# EAGLE design robot001 (EAGLE 9.5.1)

## Sheet 1 of 3
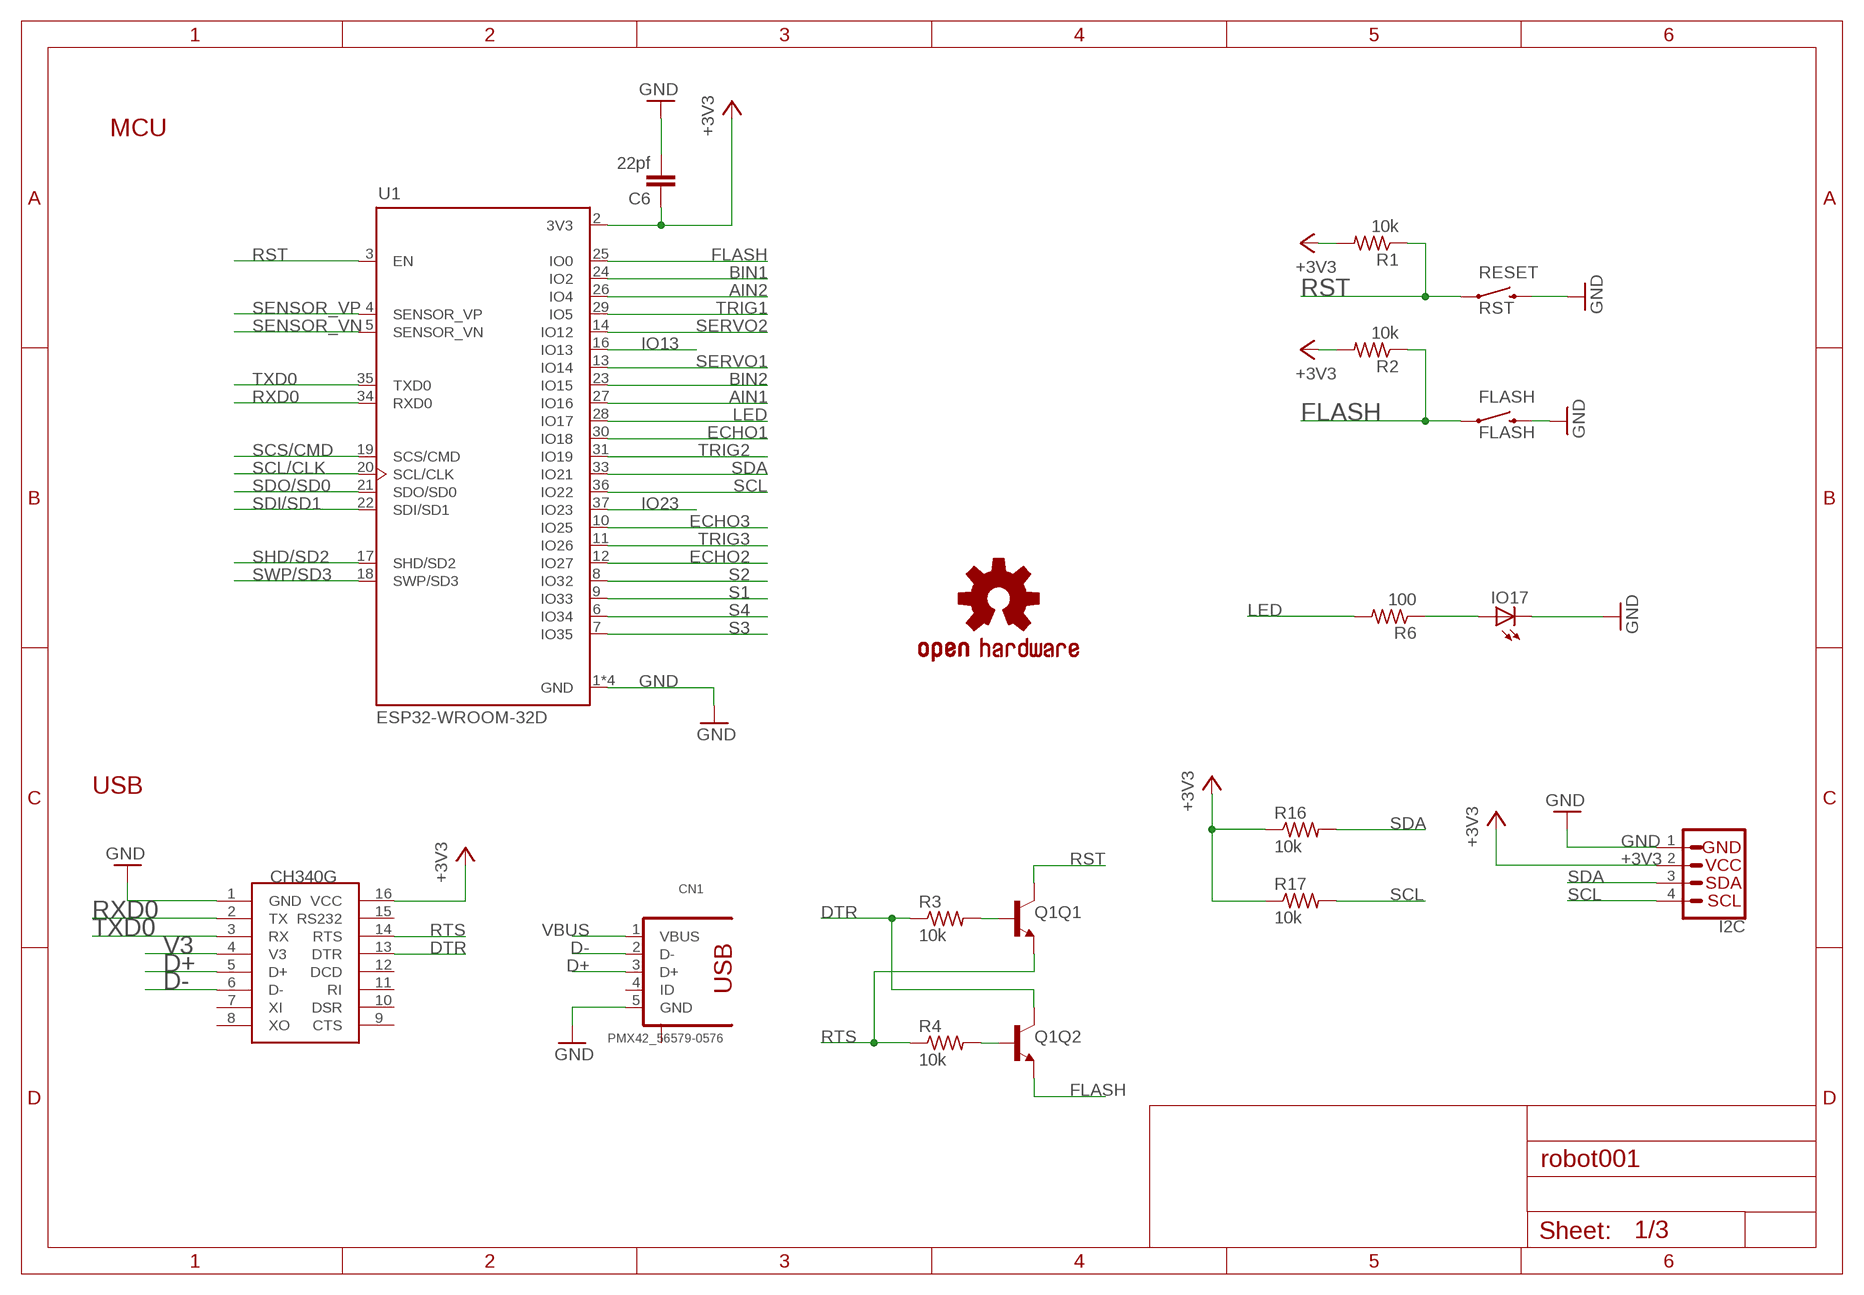
[diagram p0: schematic, sheet 1]

### Parts
C6  22pf  C-EUC0402  [C0402]
CN1  PMX42_56579-0576  [PMX42_56579-0576]
FLASH  FLASH  RS032G05A3SM-SPST-MOMENTARY-SWSMD-1101NE  [TACTILE-SWITCH-1101NE]
I2C  I2C_STANDARD  [1X04]
IO17  LEDCHIPLED_1206  [CHIPLED_1206]
LOGO1  OSHW-LOGOS  [OSHW-LOGO-S]
Q1  TRANS_NPN_DUAL-MBT3904DW1T1  [SC70-6]
R1  10k  R-US_R0402  [R0402]
R2  10k  R-US_R0402  [R0402]
R3  10k  R-US_R0402  [R0402]
R4  10k  R-US_R0402  [R0402]
R6  100  R-US_R0402  [R0402]
R16  10k  R-US_R0402  [R0402]
R17  10k  R-US_R0402  [R0402]
RESET  RST  RS032G05A3SM-SPST-MOMENTARY-SWSMD-1101NE  [TACTILE-SWITCH-1101NE]
U1  ESP32-WROOM-32D  [MODULE_ESP32-WROOM-32D]
U$1  CH340G  [SOIC16]

### Nets
+3V3: C6.1 I2C.2 R1.2 R2.2 R16.1 R17.1 U1.2(3V3) U$1.16(VCC) ; also sheet 2,3
AIN1: U1.27(IO16) ; also sheet 2
AIN2: U1.26(IO4) ; also sheet 2
BIN1: U1.24(IO2) ; also sheet 2
BIN2: U1.23(IO15) ; also sheet 2
D+: CN1.3(D+) U$1.5(D+)
D-: CN1.2(D-) U$1.6(D-)
DTR: Q1.6(Q2:C) R3.1 U$1.13(DTR)
ECHO1: U1.30(IO18) ; also sheet 2
ECHO2: U1.12(IO27) ; also sheet 2
ECHO3: U1.10(IO25) ; also sheet 2
FLASH: FLASH.1 Q1.1(Q2:E) R2.1 U1.25(IO0)
GND: C6.2 CN1.5(GND) FLASH.2 I2C.1 IO17.C RESET.2 U1.1(GND) U1.15(GND) U1.38(GND) U1.39(GND) U$1.1(GND) ; also sheet 2,3
IO13: U1.16(IO13)
IO23: U1.37(IO23)
LED: R6.2 U1.28(IO17)
N$1: Q1.5(Q1:B) R3.2
N$2: Q1.2(Q2:B) R4.2
N$4: IO17.A R6.1
RST: Q1.3(Q1:C) R1.1 RESET.1 U1.3(EN)
RTS: Q1.4(Q1:E) R4.1 U$1.14(RTS)
RXD0: U1.34(RXD0) U$1.2(TX)
S1: U1.9(IO33) ; also sheet 2
S2: U1.8(IO32) ; also sheet 2
S3: U1.7(IO35) ; also sheet 2
S4: U1.6(IO34) ; also sheet 2
SCL: I2C.4 R17.2 U1.36(IO22)
SCL/CLK: U1.20(SCL/CLK)
SCS/CMD: U1.19(SCS/CMD)
SDA: I2C.3 R16.2 U1.33(IO21)
SDI/SD1: U1.22(SDI/SD1)
SDO/SD0: U1.21(SDO/SD0)
SENSOR_VN: U1.5(SENSOR_VN)
SENSOR_VP: U1.4(SENSOR_VP)
SERVO1: U1.13(IO14) ; also sheet 2
SERVO2: U1.14(IO12) ; also sheet 2
SHD/SD2: U1.17(SHD/SD2)
SWP/SD3: U1.18(SWP/SD3)
TRIG1: U1.29(IO5) ; also sheet 2
TRIG2: U1.31(IO19) ; also sheet 2
TRIG3: U1.11(IO26) ; also sheet 2
TXD0: U1.35(TXD0) U$1.3(RX)
V3: U$1.4(V3)
VBUS: CN1.1(VBUS) ; also sheet 2
Unconnected: CN1.4(ID) CN1.S1(S) CN1.S2(S) CN1.S3(S) CN1.S4(S) U$1.7(XI) U$1.8(XO) U$1.9(CTS) U$1.10(DSR) U$1.11(RI) U$1.12(DCD) U$1.15(RS232)

### Notes on the sheet
- MCU
- USB

## Sheet 2 of 3
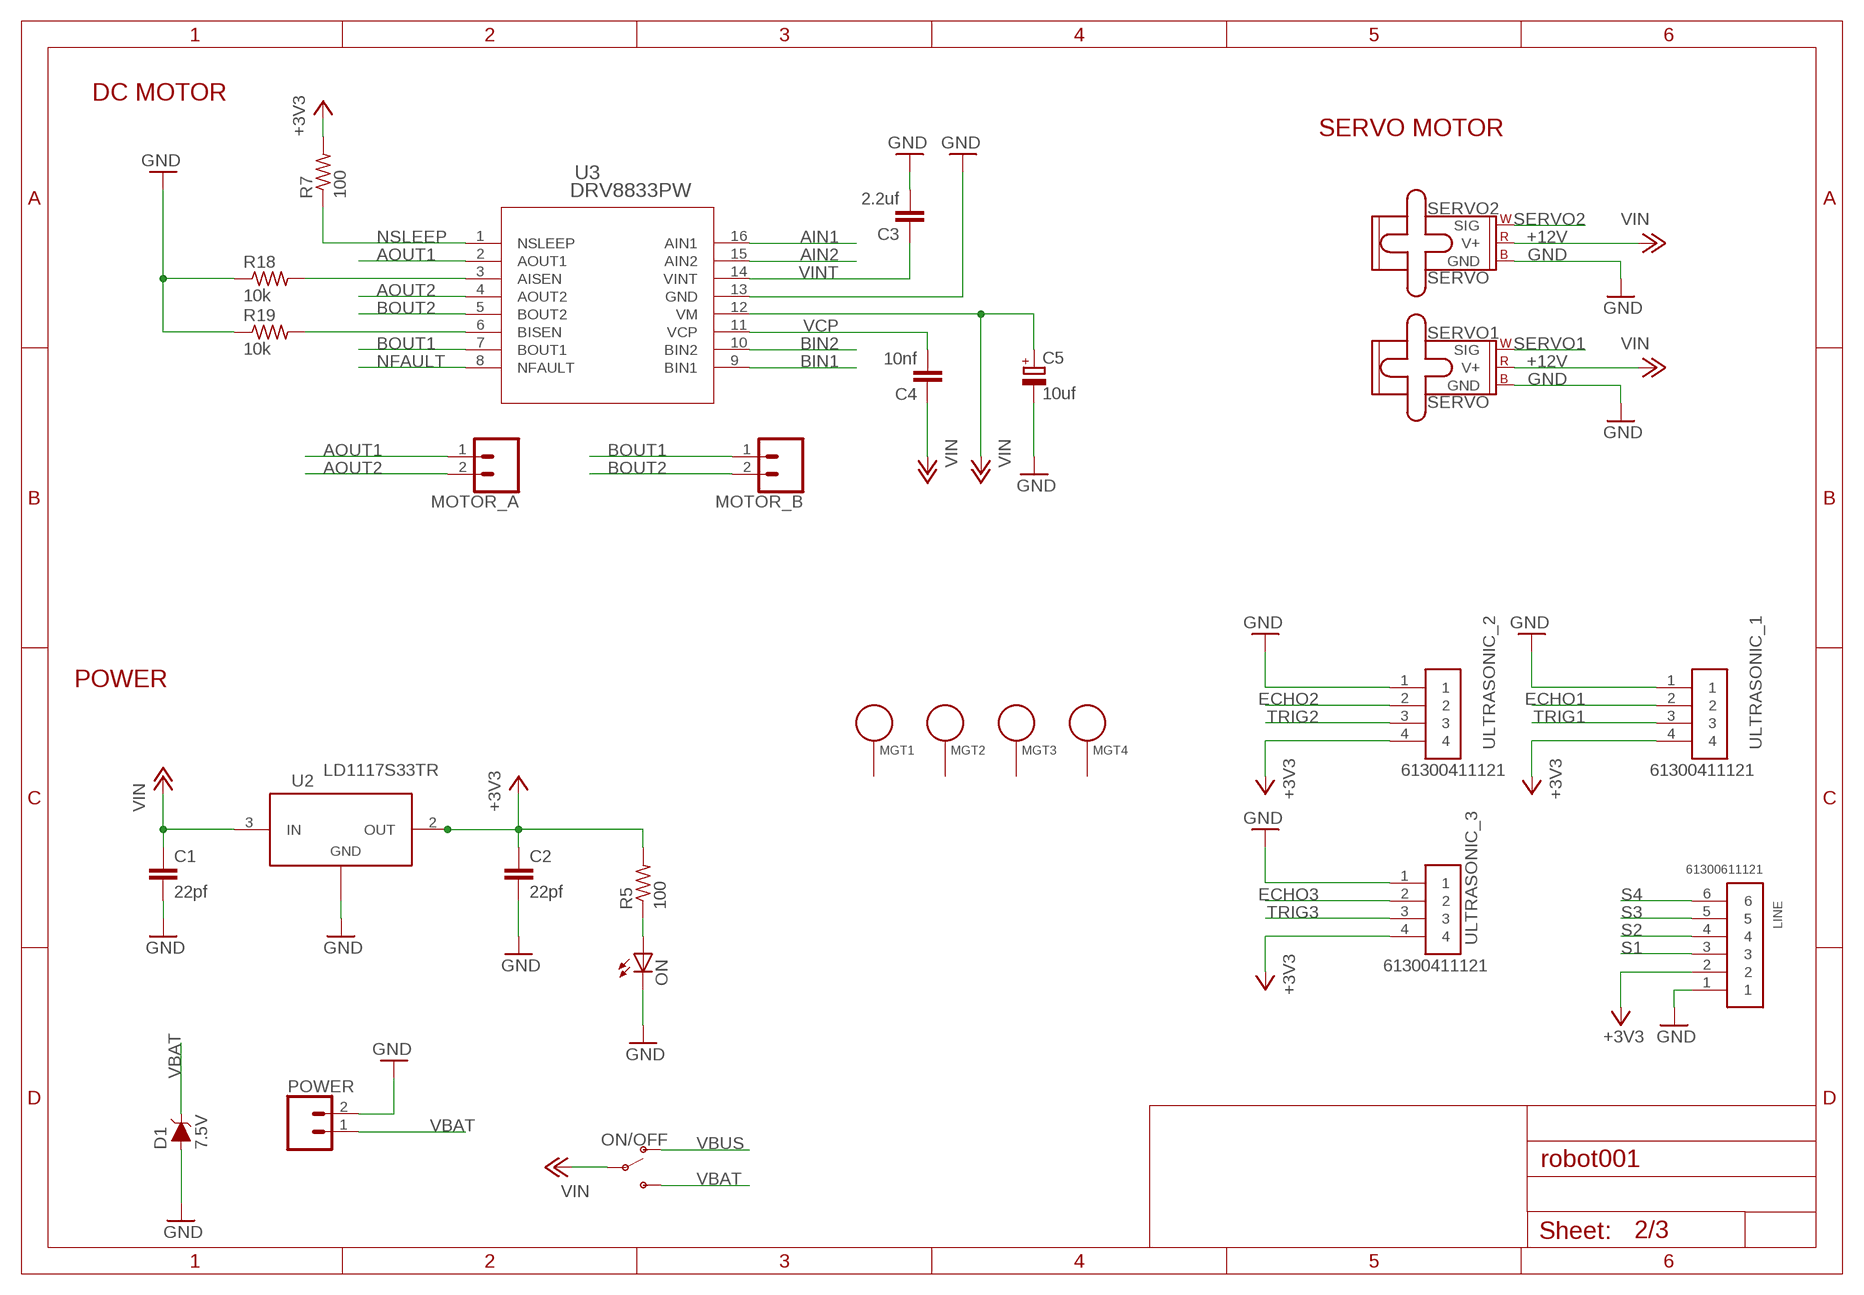
[diagram p1: schematic, sheet 2]

### Parts
C1  22pf  C-EUC0402  [C0402]
C2  22pf  C-EUC0402  [C0402]
C3  2.2uf  C-EUC0402  [C0402]
C4  10nf  C-EUC0402  [C0402]
C5  10uf  CPOL-EUB  [PANASONIC_B]
D1  7.5V  DIODE-ZENER-BZT52C3V6S  [SOD-323]
LINE  61300611121  [61300611121]
MGT1  BEAGLEBONEBLACK_MOUNTING_HOLE  [BEAGLEBONEBLACK_MOUNTING_HOLE]
MGT2  BEAGLEBONEBLACK_MOUNTING_HOLE  [BEAGLEBONEBLACK_MOUNTING_HOLE]
MGT3  BEAGLEBONEBLACK_MOUNTING_HOLE  [BEAGLEBONEBLACK_MOUNTING_HOLE]
MGT4  BEAGLEBONEBLACK_MOUNTING_HOLE  [BEAGLEBONEBLACK_MOUNTING_HOLE]
MOTOR_A  CONN_02  [1X02]
MOTOR_B  CONN_02  [1X02]
ON  LEDCHIPLED_1206  [CHIPLED_1206]
ON/OFF  SWITCH-SPDT-SMD-AYZ0202  [SWITCH_DPDT_SMD_AYZ0202]
POWER  CONN_02  [1X02]
R5  100  R-US_R0402  [R0402]
R7  100  R-US_R0402  [R0402]
R18  10k  R-US_R0402  [R0402]
R19  10k  R-US_R0402  [R0402]
SERVO1  SERVO  [1X03]
SERVO2  SERVO  [1X03]
U2  LD1117S33TR  [SOT-223]
U3  DRV8833PW  [PW16]
ULTRASONIC_1  61300411121  [61300411121]
ULTRASONIC_2  61300411121  [61300411121]
ULTRASONIC_3  61300411121  [61300411121]

### Nets
+3V3: C2.1 LINE.2 R5.2 R7.2 U2.2(OUT) U2.4 ULTRASONIC_1.4 ULTRASONIC_2.4 ULTRASONIC_3.4 ; also sheet 1,3
+12V: C1.1 C4.1 C5.+ ON/OFF.2(P) SERVO1.2(V+) SERVO2.2(V+) U2.3(IN) U3.12(VM) ; supply symbol labelled VIN
AIN1: U3.16(AIN1) ; also sheet 1
AIN2: U3.15(AIN2) ; also sheet 1
AOUT1: MOTOR_A.1 U3.2(AOUT1)
AOUT2: MOTOR_A.2 U3.4(AOUT2)
BIN1: U3.9(BIN1) ; also sheet 1
BIN2: U3.10(BIN2) ; also sheet 1
BOUT1: MOTOR_B.1 U3.7(BOUT1)
BOUT2: MOTOR_B.2 U3.5(BOUT2)
ECHO1: ULTRASONIC_1.2 ; also sheet 1
ECHO2: ULTRASONIC_2.2 ; also sheet 1
ECHO3: ULTRASONIC_3.2 ; also sheet 1
GND: C1.2 C2.2 C3.2 C5.- D1.A LINE.1 ON.C POWER.2 R18.1 R19.1 SERVO1.3(GND) SERVO2.3(GND) U2.1(ADJ/GND) U3.13(GND) ULTRASONIC_1.1 ULTRASONIC_2.1 ULTRASONIC_3.1 ; also sheet 1,3
N$3: ON.A R5.1
N$9: R18.2 U3.3(AISEN)
N$10: R19.2 U3.6(BISEN)
NFAULT: U3.8(NFAULT)
NSLEEP: R7.1 U3.1(NSLEEP)
S1: LINE.3 ; also sheet 1
S2: LINE.4 ; also sheet 1
S3: LINE.5 ; also sheet 1
S4: LINE.6 ; also sheet 1
SERVO1: SERVO1.1(SIG) ; also sheet 1
SERVO2: SERVO2.1(SIG) ; also sheet 1
TRIG1: ULTRASONIC_1.3 ; also sheet 1
TRIG2: ULTRASONIC_2.3 ; also sheet 1
TRIG3: ULTRASONIC_3.3 ; also sheet 1
VBAT: D1.C ON/OFF.3(S) POWER.1
VBUS: ON/OFF.1(O) ; also sheet 1
VCP: C4.2 U3.11(VCP)
VINT: C3.1 U3.14(VINT)
Unconnected: MGT1.P$1 MGT2.P$1 MGT3.P$1 MGT4.P$1

### Notes on the sheet
- DC MOTOR
- SERVO MOTOR
- POWER

## Sheet 3 of 3
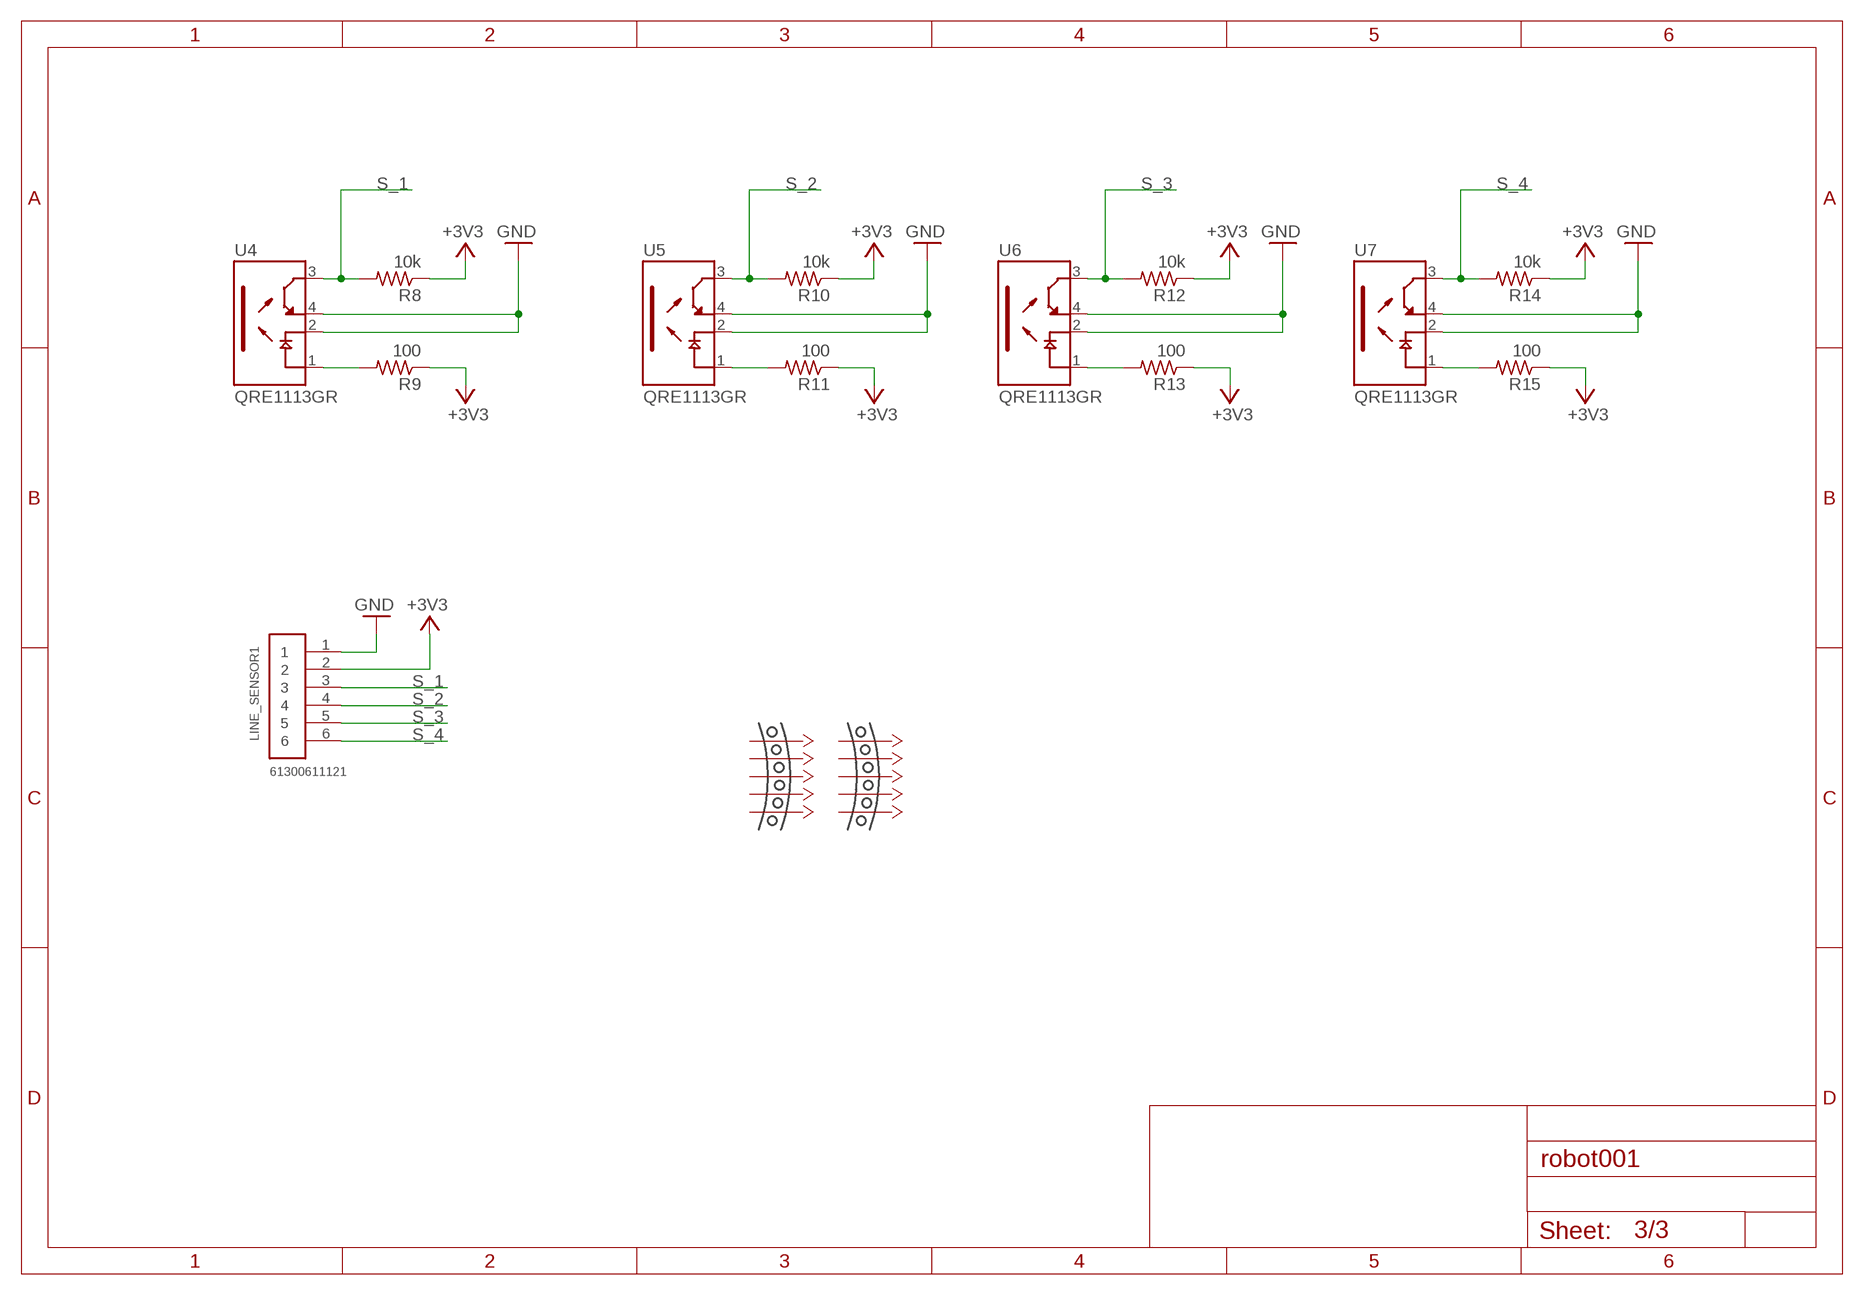
[diagram p2: schematic, sheet 3]

### Parts
LINE_SENSOR1  61300611121  [61300611121]
R8  10k  R-US_R0402  [R0402]
R9  100  R-US_R0402  [R0402]
R10  10k  R-US_R0402  [R0402]
R11  100  R-US_R0402  [R0402]
R12  10k  R-US_R0402  [R0402]
R13  100  R-US_R0402  [R0402]
R14  10k  R-US_R0402  [R0402]
R15  100  R-US_R0402  [R0402]
U4  QRE1113GR  [SOIC180P460X187-4N]
U5  QRE1113GR  [SOIC180P460X187-4N]
U6  QRE1113GR  [SOIC180P460X187-4N]
U7  QRE1113GR  [SOIC180P460X187-4N]
U$2  MOUSE-BITES-5  [MOUSE-BITES-5]
U$3  MOUSE-BITES-5  [MOUSE-BITES-5]

### Nets
+3V3: LINE_SENSOR1.2 R8.1 R9.1 R10.1 R11.1 R12.1 R13.1 R14.1 R15.1 ; also sheet 1,2
GND: LINE_SENSOR1.1 U4.2(C) U4.4(ET) U5.2(C) U5.4(ET) U6.2(C) U6.4(ET) U7.2(C) U7.4(ET) ; also sheet 1,2
N$5: R11.2 U5.1(A)
N$6: R9.2 U4.1(A)
N$7: R13.2 U6.1(A)
N$8: R15.2 U7.1(A)
S_1: LINE_SENSOR1.3 R8.2 U4.3(CT)
S_2: LINE_SENSOR1.4 R10.2 U5.3(CT)
S_3: LINE_SENSOR1.5 R12.2 U6.3(CT)
S_4: LINE_SENSOR1.6 R14.2 U7.3(CT)
Unconnected: U$2.1 U$2.2 U$2.3 U$2.4 U$2.5 U$3.1 U$3.2 U$3.3 U$3.4 U$3.5

## Library data of the parts
C1-C4 C6 = resistor:C-EU: CAPACITOR, European symbol
C5 = resistor:CPOL-EU: POLARIZED CAPACITOR, European symbol
CN1 = 52101-101-REV-A:PMX42_56579-0576: USB - OTG, miniUSB Type AB, Molex
D1 = SparkFun-DiscreteSemi:DIODE-ZENER: Zener Diode A Zener diode allows current to flow from its anode to its cathode like a normal semiconductor diode, but it also permits current to flow in the reverse direction when its "Zener voltage" is reached. - WIkipedia; PROD_ID: DIO-08199; VALUE: 3.6V
FLASH RESET = BeagleBone_Blue_R3:RS032G05A3SM-SPST-MOMENTARY-SW: 6x3.5mm 2-pin Momentary Switch (Push-button) Digikey Link <https://www.digikey.com/products/en?keywords=CKN10388TR-ND> Datasheet <https://media.digikey.com/pdf/Data%20Sheets/C&K/RS-032G05_-SM_RT.pdf>; PROD_ID: SWCH-00815
I2C = SparkFun-Connectors:I2C_STANDARD: SparkFun I2C Standard Pinout Header SparkFun has standardized on a pinout for all I2C based sensor breakouts. This pinout allows I2C boards to be plugged directly into the headers on Arduino Uno compatible boards, and to be daisy chained easily. Example SparkFun Products: SparkFun Atmospheric Sensor Breakout - BME280 <https://www.sparkfun.com/products/13676> SparkFun Altitude/Pressure Sensor Breakout - MPL3115A2 <https://www.sparkfun.com/products/11084> SparkFun TOF Range Finder Sensor - VL6180 <https://www.sparkfun.com/products/12785>
IO17 ON = adafruit:LED: LED OSRAM: - CHIPLED LG R971, LG N971, LY N971, LG Q971, LY Q971, LO R971, LY R971 LH N974, LH R974 LS Q976, LO Q976, LY Q976 LO Q996 - Hyper CHIPLED LW Q18S LB Q993, LB Q99A, LB R99A - SideLED LS A670, LO A670, LY A670, LG A670, LP A670 LB A673, LV A673, LT A673, LW A673 LH A674 LY A675 LS A676, LA A676, LO A676, LY A676, LW A676 LS A679, LY A679, LG A679 - Hyper Micro SIDELED® LS Y876, LA Y876, LO Y876, LY Y876 LT Y87S - SmartLED LW L88C, LW L88S LB L89C, LB L89S, LG L890 LS L89K, LO L89K, LY L89K LS L896, LA L896, LO L896, LY L896 - TOPLED LS T670, LO T670, LY T670, LG T670, LP T670 LSG T670, LSP T670, LSY T670, LOP T670, LYG T670 LG T671, LOG T671, LSG T671 LB T673, LV T673, LT T673, LW T673 LH T674 LS T676, LA T676, LO T676, LY T676, LB T676, LH T676, LSB T676, LW T676 LB T67C, LV T67C, LT T67C, LS T67K, LO T67K, LY T67K, LW E67C LS E67B, LA E67B, LO E67B, LY E67B, LB E67C, LV E67C, LT E67C LW T67C LS T679, LY T679, LG T679 LS T770, LO T770, LY T770, LG T770, LP T770 LB T773, LV T773, LT T773, LW T773 LH T774 LS E675, LA E675, LY E675, LS T675 LS T776, LA T776, LO T776, LY T776, LB T776 LHGB T686 LT T68C, LB T68C - Hyper Mini TOPLED® LB M676 - Mini TOPLED Santana® LG M470 LS M47K, LO M47K, LY M47K Source: http://www.osram.convergy.de/
LINE LINE_SENSOR1 = Headers:61300611121: CONN HEADER VERT 6POS 2.54MM Manufacturer's datasheet <https://katalog.we-online.de/em/datasheet/6130xx11121.pdf>; CREATED_BY: PCBLayout.com; DIGI_KEY_PART_NUMBER: 732-5319-ND; MANUFACTURER: Wurth Electronics Inc.; MPN: 61300611121
LOGO1 = Particle-Devices:OSHW-LOGO: Open Source Hardware Logo This logo indicates the piece of hardware it is found on incorporates a OSHW license and/or adheres to the definition of open source hardware found here: http://freedomdefined.org/OSHW
MGT1-MGT4 = BeagleBone_Black_Wireless:BEAGLEBONEBLACK_MOUNTING_HOLE: Chassis Mounting Hole w/GND connection ability
MOTOR_A MOTOR_B POWER = SparkFun-Connectors:CONN_02: Multi connection point. Often used as Generic Header-pin footprint for 0.1 inch spaced/style header connections On any of the 0.1 inch spaced packages, you can populate with these: Break Away Headers - Straight <https://www.sparkfun.com/products/116> (PRT-00116) Break Away Male Headers - Right Angle <https://www.sparkfun.com/products/553> (PRT-00553) Female Headers <https://www.sparkfun.com/products/115> (PRT-00115) Break Away Headers - Machine Pin <https://www.sparkfun.com/products/117> (PRT-00117) Break Away Female Headers - Swiss Machine Pin <https://www.sparkfun.com/products/743> (PRT-00743) For SCREWTERMINALS and SPRING TERMINALS visit here: Screw Terimnals on SparkFun.com <https://www.sparkfun.com/search/results?term=Screw+Terminals> (5mm/3.5mm/2.54mm spacing) This device is also useful as a general connection point to wire up your design to another part of your project. Our various solder wires solder well into these plated through hole pads. Hook-Up Wire - Assortment (Stranded, 22 AWG) <https://www.sparkfun.com/products/11375> (PRT-11375) Hook-Up Wire - Assortment (Solid Core, 22 AWG) <https://www.sparkfun.com/products/11367> (PRT-11367) View the entire wire category on our website here <https://www.sparkfun.com/categories/141> Special notes: Molex polarized connector foot print use with: PRT-08233 with associated crimp pins and housings. 2.54_SCREWTERM for use with PRT-10571. 3.5mm Screw Terminal footprints for PRT-08084 5mm Screw Terminal footprints for use with PRT-08432
ON/OFF = SparkFun-Switches:SWITCH-SPDT: Single Pole, Double Throw (SPDT) Switch Single-pole, double-throw (SPDT) switch. Variant Overview SMD-AYZ0202 Surface Mount DPDT Switch <https://www.sparkfun.com/products/597> (COM-00597) Used on e.g. LilyPad Arduino USB - ATmega32U4 Board <https://www.sparkfun.com/products/12049> PTH-11.6X4.0MM SPDT Mini Power Switch <https://www.sparkfun.com/products/102> (COM-00102) Used on e.g. SparkFun Simon Says - Through-Hole Soldering Kit <https://www.sparkfun.com/products/10547> (KIT-10547) PTH-11.6X4.0MM-KIT KIT version of SPDT Mini Power Switch - Simplifies soldering by removing tStop of switch pins - only one side can be soldered. PTH-11.6X4.0MM-LOCK LOCK version of SPDT Mini Power Switch - Offset pins hold switch in place for easier soldering. SMD-RIGHT-ANGLE Surface Mount Right Angle Switch <https://www.sparkfun.com/products/10860> (COM-10860) Used on e.g. SparkFun ESP8266 Thing <https://www.sparkfun.com/products/13231>; PROD_ID: SWCH-08179; SF_ID: COM-00597
Q1 = SparkFun-DiscreteSemi:TRANS_NPN_DUAL: Dual NPN Transistors in Single Package The MBT3904W1 puts two general purpose 3904 NPN transistors in a single package. Datasheet <http://www.onsemi.com/pub_link/Collateral/MBT3904DW1T1-D.PDF> SparkFun Products: SparkFun ESP32 Thing <https://www.sparkfun.com/products/13907>; PROD_ID: TRANS-13337
R1-R19 = resistor:R-US_: RESISTOR, American symbol
SERVO1 SERVO2 = SparkFun-Electromechanical:SERVO: Servo Motor 3-pin connector for a standard servo motor (voltage supply, ground, and control signal.) SparkFun Products Servo - Generic (Sub-Micro Size) <https://www.sparkfun.com/products/9065> (ROB-09065) Servo - Generic High Torque Continuous Rotation (Standard Size) <https://www.sparkfun.com/products/9347> (ROB-09347) Servo - Generic High Torque (Standard Size) <https://www.sparkfun.com/products/11965> (ROB-11965)
U1 = ESP32-WROOM-32D:ESP32-WROOM-32D: IC: SoC; GPIO, I2C, I2S, IR, SD, SDIO, SPI, UART; 2.7÷3.6VDC; 20dBm; AVAILABILITY: Unavailable; DESCRIPTION: Bluetooth, WiFi 802.11b/g/n, Bluetooth v4.2 + EDR, Class 1, 2 and 3 Transceiver Module 2.4GHz ~ 2.5GHz Integrated, Trace Surface Mount; MF: Espressif Systems; MP: ESP32-WROOM-32D; PACKAGE: Module Espressif Systems; PRICE: None
U2 = IC:LD1117S33TR: IC REG LINEAR 3.3V 800MA SOT223 Manufacturer's datasheet <http://www.st.com/content/ccc/resource/technical/document/datasheet/99/3b/7d/91/91/51/4b/be/CD00000544.pdf/files/CD00000544.pdf/jcr:content/translations/en.CD00000544.pdf>; CREATED_BY: PCBLayout.com; DIGIKEY_PART_NUMBER: 497-1242-2-ND; MANUFACTURER: STMicroelectronics; MPN: LD1117S33TR; PACKAGE: SOT-223
U3 = DRV8833:DRV8833PW; MANUFACTURER_PART_NUMBER: DRV8833PW; VENDOR: Texas Instruments
U4-U7 = QRE1113GR:QRE1113GR: QRE1113 Series 30 V 50 mA Miniature Reflective Object Sensor - SMD-4; DESCRIPTION: Reflective Optical Sensor 0.197 _5mm_ 4-SMD, Gull Wing; DIGI-KEY_PART_NUMBER: QRE1113GRCT-ND; DIGI-KEY_PURCHASE_URL: https://www.digikey.com/product-detail/en/on-semiconductor/QRE1113GR/QRE1113GRCT-ND/965713?utm_source=snapeda&utm_medium=aggregator&utm_campaign=symbol; MF: ON Semiconductor; MP: QRE1113GR; PACKAGE: SMD-4 ON Semiconductor
U$1 = ch340g:CH340G
U$2 U$3 = mouse-bites:MOUSE-BITES-5
ULTRASONIC_1-ULTRASONIC_3 = Headers:61300411121: CONN HEADER VERT 4POS 2.54MM Manufacturer's datasheet <https://katalog.we-online.de/em/datasheet/6130xx11121.pdf>; CREATED_BY: PCBLayout.com; DIGI_KEY_PART_NUMBER: 732-5317-ND; MANUFACTURER: Wurth Electronics Inc.; MPN: 61300411121

## Board
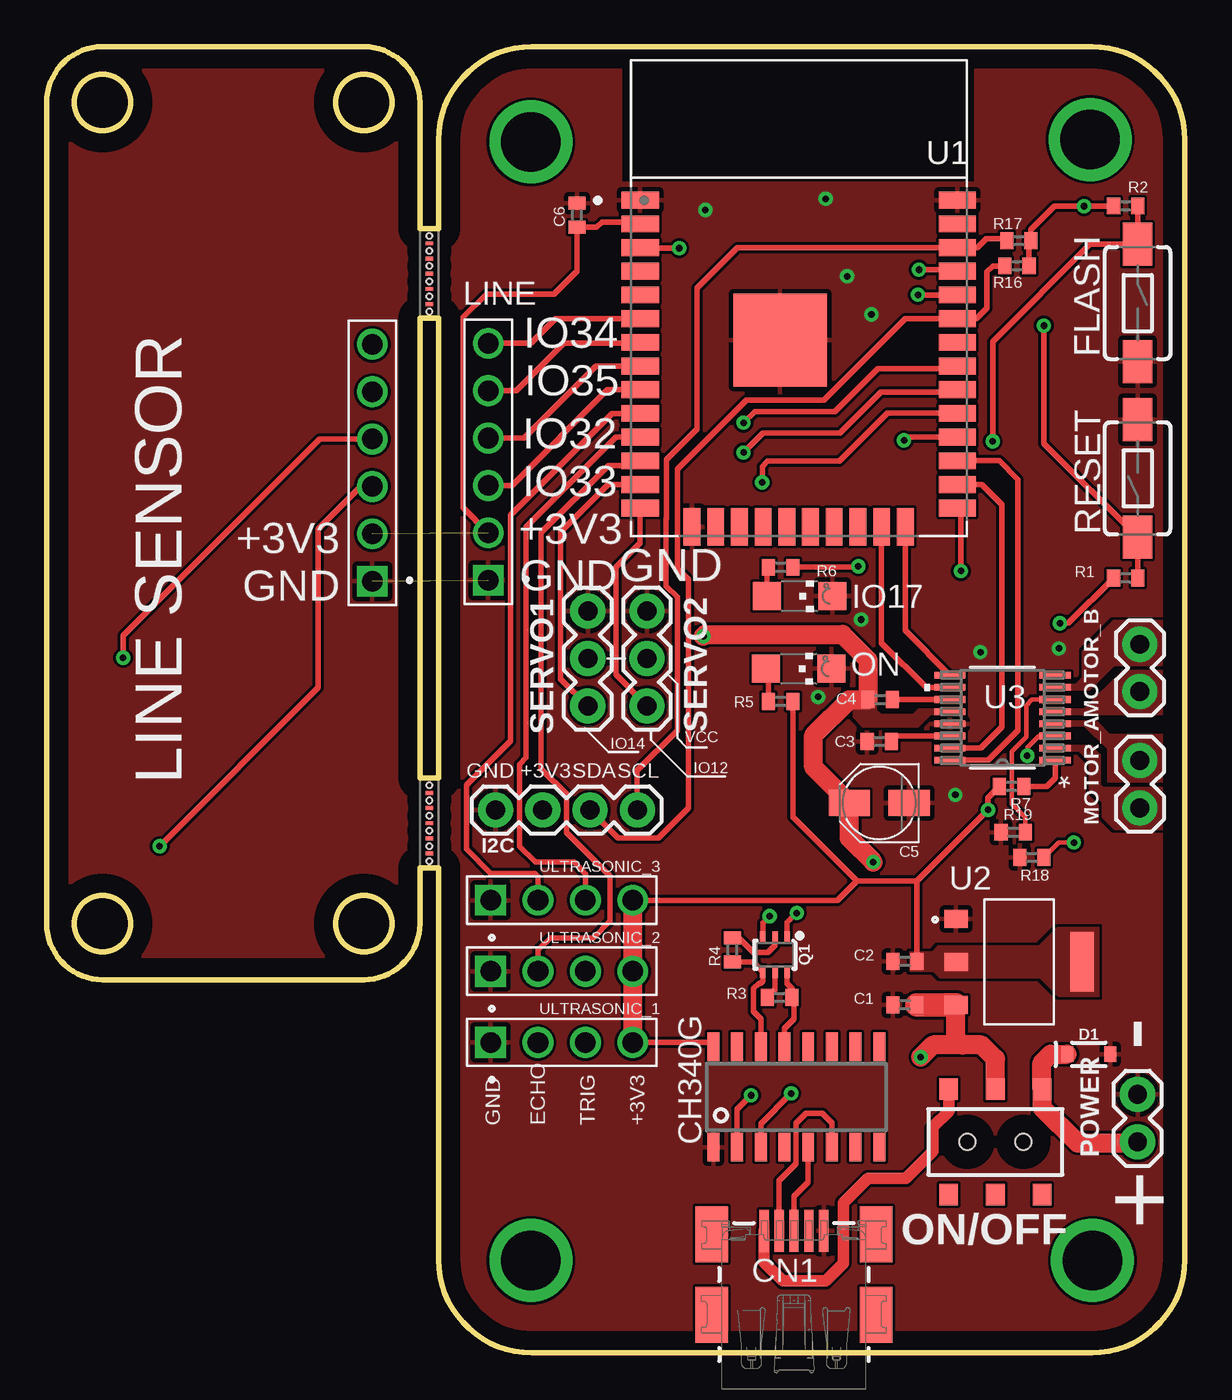
[diagram p3: board, top side]
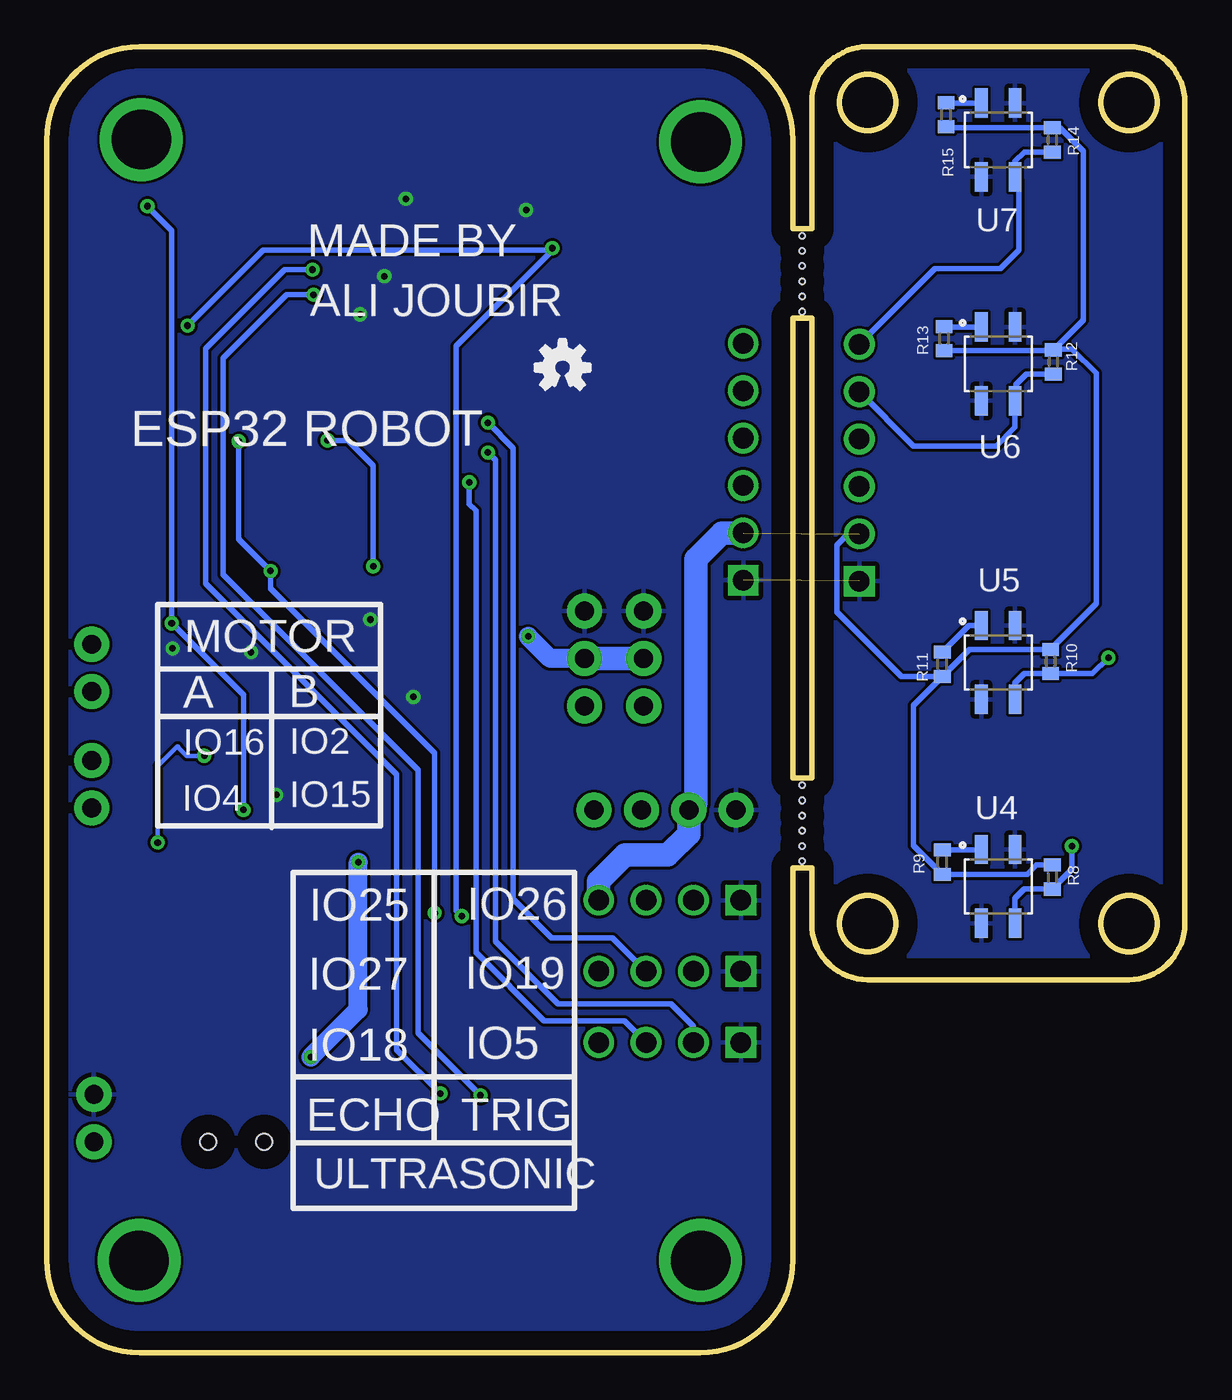
[diagram p4: board, bottom side, seen from below]

Size 61 x 70 mm. Coordinates in mm from the lower left corner, seen from the top.
Outline: 20,55.46 21,55.46 21,30.8 20,30.8 20,55.46
Outline: 20,67 20,60.26 21,60.26 21,65 arc-90 26,70 56,70 arc-90 61,65 61,5 arc-90 56,0 26,0 arc-90 21,5 21,26 20,26 20,23 arc-90 17,20 3,20 arc-90 0,23 0,67 arc-90 3,70 17,70 arc-90 20,67
Outline: circle at 17,23 radius 1.5
Outline: circle at 3,23 radius 1.5
Outline: circle at 17,67 radius 1.5
Outline: circle at 3,67 radius 1.5
Copper layers (1*16): Top 0.035mm / dielectric 1.5mm / Bottom 0.035mm
Design rules "default": minimum track width 6mil, minimum drill 0.35mm, track to track 6mil, track to pad 6mil, pad to pad 6mil, via to via 6mil, smd to smd 6mil, copper to edge 40mil, drill to drill 6mil, minimum pad ring 10mil, minimum via ring 8mil, stop-mask expansion 4mil, vias tented up to drill 0mil, thermal gap 10mil
tRestrict: area 30.8,62.8 to 49.7,69

### Footprints (pad centres in the part's own frame; a part is rotated, then mirrored left to right if it is on the bottom)
C0402 = smd 0.7 x 0.9: 1 -0.65,0; 2 0.65,0
PANASONIC_B = smd 2.2 x 1.4: + 1.6,0; - -1.6,0
PMX42_56579-0576 = smd 0.5 x 2.25: 1 1.6,-0.2; 2 0.8,-0.2; 3 0,-0.2; 4 -0.8,-0.2; 5 -1.6,-0.2 | smd 1.75 x 3: S1 -4.4,0; S2 4.4,0; S3 -4.4,4.3; S4 4.4,4.3
SOD-323 = smd 0.63 x 0.83: A 1.15,0; C -1.15,0
TACTILE-SWITCH-1101NE = smd 2.3 x 1.6: 1 -3.15,0; 2 3.15,0
1X04 = drill 1.016 pad 1.88: 1 0,0; 2 2.54,0; 3 5.08,0; 4 7.62,0
CHIPLED_1206 = smd 1.5 x 1.5: A 0,-1.75; C 0,1.75
61300611121 = drill 1.1 square: 1 -6.35,0 | drill 1.1: 2 -3.81,0; 3 -1.27,0; 4 1.27,0; 5 3.81,0; 6 6.35,0
BEAGLEBONEBLACK_MOUNTING_HOLE = drill 3.175 pad 4.445: P$1 0,0
1X02 = drill 1.016 pad 1.88: 1 0,0; 2 2.54,0
SWITCH_DPDT_SMD_AYZ0202 = smd 1 x 1.15: 1 -2.5,2.825; 2 0,2.825; 3 2.5,2.825; 4 -2.5,-2.825; 5 0,-2.825; 6 2.5,-2.825 | hole 0.85: 1.5,0; -1.5,0
SC70-6 = smd 0.3 x 0.66: 1 -0.65,-0.92; 2 0,-0.92; 3 0.65,-0.92; 4 0.65,0.92; 5 0,0.92; 6 -0.65,0.92
R0402 = smd 0.7 x 0.9: 1 -0.65,0; 2 0.65,0
1X03 = drill 1.016 pad 1.88: 1 0,0; 2 2.54,0; 3 5.08,0
MODULE_ESP32-WROOM-32D = smd 2 x 0.9: 1 -8.5,5.26; 2 -8.5,3.99; 3 -8.5,2.72; 4 -8.5,1.45; 5 -8.5,0.18; 6 -8.5,-1.09; 7 -8.5,-2.36; 8 -8.5,-3.63; 9 -8.5,-4.9; 10 -8.5,-6.17; 11 -8.5,-7.44; 12 -8.5,-8.71; 13 -8.5,-9.98; 14 -8.5,-11.25; 25 8.5,-11.25; 26 8.5,-9.98; 27 8.5,-8.71; 28 8.5,-7.44; 29 8.5,-6.17; 30 8.5,-4.9; 31 8.5,-3.63; 32 8.5,-2.36; 33 8.5,-1.09; 34 8.5,0.18; 35 8.5,1.45; 36 8.5,2.72; 37 8.5,3.99; 38 8.5,5.26 | smd 0.9 x 2: 15 -5.715,-12.25; 16 -4.445,-12.25; 17 -3.175,-12.25; 18 -1.905,-12.25; 19 -0.635,-12.25; 20 0.635,-12.25; 21 1.905,-12.25; 22 3.175,-12.25; 23 4.445,-12.25; 24 5.715,-12.25 | smd 5 x 5: 39 -1,-2.24
SOT-223 = smd 1.26 x 0.96: 1 -3.375,2.3; 2 -3.375,0; 3 -3.375,-2.3 | smd 1.26 x 3.19: 4 3.375,0
PW16 = smd 1.676 x 0.356: 1 -2.819,2.275; 2 -2.819,1.625; 3 -2.819,0.975; 4 -2.819,0.325; 5 -2.819,-0.325; 6 -2.819,-0.975; 7 -2.819,-1.625; 8 -2.819,-2.275; 9 2.819,-2.275; 10 2.819,-1.625; 11 2.819,-0.975; 12 2.819,-0.325; 13 2.819,0.325; 14 2.819,0.975; 15 2.819,1.625; 16 2.819,2.275
SOIC180P460X187-4N = smd 0.69 x 1.57: 1 -0.9,1.975; 2 -0.9,-1.975; 3 0.9,-1.975; 4 0.9,1.975
SOIC16 = smd 0.635 x 1.524: 1 -4.445,-2.695; 2 -3.175,-2.695; 3 -1.905,-2.695; 4 -0.635,-2.695; 5 0.635,-2.695; 6 1.905,-2.695; 7 3.175,-2.695; 8 4.445,-2.695; 9 4.445,2.695; 10 3.175,2.695; 11 1.905,2.695; 12 0.635,2.695; 13 -0.635,2.695; 14 -1.905,2.695; 15 -3.175,2.695; 16 -4.445,2.695
MOUSE-BITES-5 = smd 0.203 x 0.406: 1 0.406,0; 2 1.219,0; 3 2.032,0; 4 2.845,0; 5 3.658,0 | hole 0.305: 0,0; 0.813,0; 1.626,0; 2.438,0; 3.251,0; 4.064,0
61300411121 = drill 1.1 square: 1 -3.81,0 | drill 1.1: 2 -1.27,0; 3 1.27,0; 4 3.81,0

### Placement (x,y rotation side)
C1  45.99,18.66 180 top
C2  45.99,20.98 180 top
C3  44.62,32.77 180 top
C4  44.67,35.01 0 top
C5  44.62,29.46 180 top
C6  28.42,60.97 90 top
CN1  40.05,6.35 180 top
D1  55.85,16 0 top
FLASH  58.47,56.26 270 top
I2C  24.05,29.08 0 top
IO17  40.35,40.55 270 top
LINE  23.67,47.75 90 top
LINE_SENSOR1  17.45,47.7 90 top
LOGO1  33.35,52.8 0 bottom
MGT1  25.95,64.9 0 top
MGT2  55.92,65.02 0 top
MGT3  25.95,4.95 0 top
MGT4  56.05,4.95 0 bottom
MOTOR_A  58.59,29.21 90 top
MOTOR_B  58.59,37.97 270 top
ON  40.3,36.66 270 top
ON/OFF  50.84,11.3 0 top
POWER  58.47,11.3 90 top
Q1  39.03,21.34 180 top
R1  57.83,41.53 180 top
R2  57.83,61.47 180 top
R3  39.29,19.05 180 top
R4  36.75,21.59 90 top
R5  39.34,34.91 0 top
R6  39.34,42.1 0 top
R7  51.72,30.36 180 top
R8  7.1,25.5 270 bottom
R9  13,26.3 90 bottom
R10  7.2,37.05 270 bottom
R11  13,36.9 90 bottom
R12  7.05,53.1 270 bottom
R13  12.9,54.35 90 bottom
R14  7.1,65 270 bottom
R15  12.8,66.35 90 bottom
R16  52,58.25 180 top
R17  52.1,59.6 180 top
R18  52.8,26.55 0 top
R19  51.8,27.9 0 top
RESET  58.47,46.86 90 top
SERVO1  29,34.67 90 top
SERVO2  32.18,34.67 90 top
U1  40.3,56.52 0 top
U2  52.11,20.95 0 top
U3  51.23,34.04 180 top
U4  10,25 0 bottom
U5  10,37 0 bottom
U6  10,53 0 bottom
U7  10,65 0 bottom
U$1  40.18,13.72 0 top
U$2  20.5,26.35 90 top
U$3  20.5,55.8 90 top
ULTRASONIC_1  27.6,16.64 0 top
ULTRASONIC_2  27.6,20.45 0 top
ULTRASONIC_3  27.6,24.26 0 top

### Tracks (layer width: path | path; a pad name or v marks a point on that pad's centre or on a via)
+3V3  (via drill 0.35)  (1 unrouted)
  Top 0.305: R7.2 50.45,29.75 v50.45,29.1 46.64,25.29 | 46.64,25.29 C2.1 | U1.2 31.71,60.6 29.75,60.6 29.47,60.32 C6.1 28.42,57.97 27.2,56.75 23.57,56.75 22.32,55.5 22.32,45.29 LINE.2 | R5.2 39.99,28.71 43.41,25.29 | 43.41,25.29 46.64,25.29 | ULTRASONIC_3.4 42.38,24.26 43.41,25.29 | ULTRASONIC_1.4 35.51,16.64 U$1.16 | R1.2 54.75,39.1 v54.3,39.1 | R2.2 57.16,61.45 v55.6,61.45 54,61.45 52.75,60.2 R17.1 52.65,59.5 R16.1
  Top 1.016: ULTRASONIC_1.4 ULTRASONIC_2.4 ULTRASONIC_3.4
  Bottom 0.305: v50.45,29.1 50.45,35.25 v54.3,39.1 54.3,60.15 v55.6,61.45 | R15.1 12.75,65.65 R14.1 6.7,65.65 5.45,64.4 5.45,55.35 7,53.8 | R13.1 7.1,53.7 R12.1 7,53.8 | R11.1 11.55,37.7 R10.1 4.75,40.15 4.75,52.5 6.05,53.8 7,53.8 | R8.1 7.95,26.15 8.45,25.65 R9.1 14.55,27.2 14.55,34.7 R11.1 | R11.1 15.2,36.25 18.65,39.7 18.65,43.3 18.06,43.89 LINE_SENSOR1.2
  Bottom 1.27: ULTRASONIC_3.4 31.41,25.27 30.02,26.67 27.73,26.67 26.59,27.81 I2C.2 26.21,29.46 26.21,42.55 24.81,43.94 LINE.2
  pour Top (no thermals): 46.3,21.5 47.5,21.5 47.8,21.8 53.2,21.8 54.2,22.8 56.35,22.8 56.35,19.1 54.25,19.1 53.25,20.1 48.65,20.1 47.9,20.1 47.55,20.45 46.3,20.45
+12V  (via drill 0.35)
  Top 0.305: U3.12 48.4,34.35
  Top 1.016: ON/OFF.2 50.84,15.76 50.1,16.5 49.1,16.5 | 49.1,16.5 48.74,16.86 U2.3 | 49.1,16.5 47.5,16.5 v46.85,15.85 | v44.3,26.3 43.02,27.58 C5.+ 41.1,31.39 41.1,33.1 43.01,35.01 C4.1 44.02,37.13 42.65,38.5 35.3,38.5 v35.2,38.4
  Top 1.27: C1.1 U2.3
  Bottom 1.016: v46.85,15.85 44.3,18.4 v44.3,26.3 | SERVO2.2 34.01,37.21 v35.2,38.4
  Bottom 1.27: SERVO1.2 SERVO2.2
  pour Top (no thermals): 48.35,34.5 48.35,34.2 47.35,34.2 46.7,33.55 43.75,33.55 43.25,34.05 43.25,35.45 44.45,35.45 44.45,34.45 44.7,34.2 46.45,34.2 46.75,34.5
AIN1
  Top 0.305: U3.16 50.46,31.76 52.05,33.35 52.05,46.8 51.05,47.8 U1.27
AIN2
  Top 0.305: U3.15 50.06,32.41 51.2,33.55 51.2,45.45 50.11,46.53 U1.26
AOUT1
  pour Top (no thermals): 54.1,32.55 55.65,32.55 55.95,32.55 56.45,32.05 56.45,30.45 56.6,30.3 60.05,30.3 60.05,28.05 57.85,28.05 57.25,28.05 56.85,28.45 56.6,28.7 56.6,29.5 55.9,30.2 55.9,31.7 55.35,32.25 54.15,32.25 54.1,32.3
AOUT2
  pour Top (no thermals): 54.15,33.85 56.25,33.85 56.95,33.15 60.05,33.15 60.05,30.6 56.9,30.6 56.9,32.35 55.65,33.6 54.15,33.6
BIN1
  Top 0.305: U3.9 46.02,38.7 U1.24
BIN2
  Top 0.305: U3.10 47.14,35.66 44.75,38.05 U1.23
BOUT1
  pour Top (no thermals): 54.27,35.81 55.16,35.81 55.54,36.2 55.54,37.59 57.2,39.24 59.99,39.24 59.99,37.08 59.73,36.83 57.2,36.83 55.88,35.51 54.27,35.51
BOUT2
  pour Top (no thermals): 54.15,34.49 55.62,34.49 57.7,36.57 59.86,36.57 59.86,34.21 54.15,34.21
D+
  Top 0.3: CN1.3 40.05,8.38 40.81,9.14 U$1.5
D-
  Top 0.3: CN1.2 39.25,9.22 40.16,10.13 40.16,12.3 40.69,12.83 41.57,12.83 42.08,12.32 U$1.6
DTR
  Top 0.3: U$1.13 39.54,17.4 40.05,17.91 40.05,18.94 R3.1 39.94,19.54 39.67,19.81 39.67,20.4 Q1.6
ECHO1  (via drill 0.35)
  Top 0.305: v37.35,48.25 38.4,49.3 42.5,49.3 44.7,51.5 48.69,51.5 U1.30
  Bottom 0.305: ULTRASONIC_1.2 26.33,17.48 27.55,18.7 33.6,18.7 36.95,22.05 36.95,47.85 v37.35,48.25
ECHO2
  Top 0.305: U1.12 31.55,47.55 30.1,47.55 26.5,43.95 26.5,31.3 27.85,29.95 27.85,27.9 30.2,25.55 30.2,23.15 29.3,22.25 27,22.25 26.33,21.58 ULTRASONIC_2.2
ECHO3
  Top 0.305: U1.10 30.3,50.34 24.85,44.9 24.85,32.78 22.51,30.44 22.51,26.99 23.8,25.7 26.15,25.7 26.33,25.52 ULTRASONIC_3.2
FLASH  (via drill 0.35)
  Top 0.305: Q1.1 39.68,23.06 v40.2,23.57 | v49,41.9 49,45.07 U1.25 | R2.1 58.47,61.45 FLASH.1 55.91,59.41 50.7,54.2 v50.7,48.85
  Bottom 0.305: v40.2,23.57 40.2,32.15 49,40.95 v49,41.9 50.7,43.6 v50.7,48.85
GND  (via drill 0.35)  (1 unrouted)
  Top 0.305: 31.65,61.62 U1.1
  other vias: 35.3,61.25 41.75,61.85 42.9,57.7 44.2,55.65 48.7,29.9 54.25,37.75 50.05,37.55 43.65,39.3 41.35,35.15
  pour Bottom (rank 2): -1.1,70.75 61.9,70.75 61.9,-0.2 19.5,-0.2 19.5,18.9 -1.1,18.9
  pour Top (rank 2): -1.15,17.35 -1.15,70.75 61.95,70.75 61.95,-0.2 19.5,-0.2 19.5,17.35
LED  (via drill 0.35)
  Top 0.305: R6.2 43.45,42.1 v43.5,42.15 | v45.95,48.9 46.12,49.08 U1.28
  Bottom 0.305: v43.5,42.15 43.5,47.55 44.85,48.9 v45.95,48.9
N$1
  Top 0.3: R3.2 39.03,19.45 Q1.5
N$2
  Top 0.3: R4.2 37.11,22.24 37.89,21.46 38.65,21.46 39.03,21.84 Q1.2
N$3
  Top 0.305: R5.1 38.69,36.53 ON.A
N$4
  Top 0.305: IO17.A 38.6,42.02 R6.1
N$5
  Bottom 0.305: R11.2 11.57,38.98 U5.1
N$6
  Bottom 0.305: R9.2 10.93,26.95 U4.1
N$7
  Bottom 0.305: R13.2 12.88,54.98 U6.1
N$8
  Bottom 0.305: R15.2 12.78,66.97 U7.1
N$9  (via drill 0.35)
  Top 0.254: 53.45,26.65 R18.2 54.25,27.35 v55.05,27.35 | v52.55,32 52.55,32.45 53.16,33.06 U3.3
  Bottom 0.254: v55.05,27.35 55.05,31.45 54,32.5 | 53.95,32.5 54,32.5 | 54,32.5 53.5,32 v52.55,32
N$10
  Top 0.254: R19.2 52.45,28.7 51.74,29.41 51.74,32.24 52.5,33 52.5,34.7 52.81,35.01 U3.6
NSLEEP
  Top 0.305: R7.1 53.61,30.36 54.05,30.8 U3.1
RST  (via drill 0.35)
  Top 0.305: Q1.3 38.38,23.03 v38.75,23.4 | v33.9,59.2 31.84,59.2 U1.3 | R1.1 58.48,43.7 RESET.1 53.45,48.73 v53.45,55.05
  Bottom 0.305: v38.75,23.4 39.05,23.7 39.05,53.95 33.95,59.05 | 33.95,59.05 33.85,59.15 v33.9,59.2 | v53.45,55.05 49.4,59.1 33.95,59.1 33.95,59.05
RTS
  Top 0.3: U$1.14 38.27,17.91 37.89,18.29 37.89,19.53 38.16,19.8 38.26,19.8 38.38,19.92 Q1.4 37.86,20.94 R4.1
RXD0  (via drill 0.35)
  Top 0.305: U1.34 v46.7,56.7 | v37.75,13.8 37,13.05 U$1.2
  Bottom 0.305: v46.7,56.7 48.15,56.7 51.55,53.3 51.55,41.7 41.1,31.25 41.1,17.15 v37.75,13.8
S1
  Top 0.3: U1.9 30.07,51.62 24.94,46.48 LINE.3
S2
  Top 0.3: U1.8 29.44,52.88 25.57,49.02 LINE.4
S3
  Top 0.3: U1.7 31.75,54.1 27.73,54.1 25.19,51.56 LINE.5
S4
  Top 0.3: LINE.6 25.95,54.1 27.28,55.42 U1.6
S_1  (via drill 0.35)
  Top 0.305: v6.05,27.15 14.55,35.65 14.55,44.15 16.83,46.43 LINE_SENSOR1.3
  Bottom 0.305: U4.3 9.1,24.35 8.6,24.85 R8.2 6.05,25.9 v6.05,27.15
S_2  (via drill 0.35)
  Top 0.305: LINE_SENSOR1.4 14.62,48.97 4.1,38.45 v4.1,37.25
  Bottom 0.305: U5.3 9.1,35.9 8.6,36.4 R10.2 4.95,36.4 v4.1,37.25
S_3
  Bottom 0.305: R12.2 8.5,52.45 9.05,51.9 9.05,51.08 U6.3 9.1,49.6 10.1,48.6 14.54,48.6 LINE_SENSOR1.5
S_4
  Bottom 0.305: R14.2 8.6,64.35 9.1,63.85 U7.3 8.9,62.83 8.9,59.1 9.9,58.1 13.4,58.1 LINE_SENSOR1.6
SCL
  Top 0.305: I2C.4 31.65,29.1 31.65,31.2 33.8,33.35 33.8,40.5 33.2,41.1 33.2,44.68 33.21,44.69 33.21,47.86 34.85,49.5 34.85,57.05 37.03,59.23 U1.36 49.89,59.23 50.35,59.7 51.35,59.7 R17.2
SDA
  Top 0.305: I2C.3 30.61,27.6 32.8,27.6 34.4,29.2 34.4,38.05 34.39,38.06 34.39,38.74 34.4,38.75 34.4,41.45 33.82,42.03 33.82,47.37 37.5,51.05 41.65,51.05 46.02,55.42 U1.33 49.83,55.42 50.4,56 50.4,57.95 50.7,58.25 R16.2
SERVO1
  Top 0.305: SERVO1.1 27.55,36.12 27.55,44 30.09,46.53 U1.13
SERVO2
  Top 0.305: SERVO2.1 30.5,36.35 30.5,42.1 31.8,43.4 U1.14
TRIG1  (via drill 0.35)
  Top 0.305: v38.35,46.65 38.35,47.5 38.64,47.79 42.49,47.79 45.05,50.35 U1.29
  Bottom 0.305: ULTRASONIC_1.3 30.04,17.8 34.35,17.8 38,21.45 38,45.15 38.35,45.5 v38.35,46.65
TRIG2  (via drill 0.35)
  Top 0.305: v37.35,49.85 37.95,50.45 42.25,50.45 44.55,52.75 48.67,52.75 U1.31
  Bottom 0.305: ULTRASONIC_2.3 30.68,22.25 33.95,22.25 36.01,24.31 36.01,38.74 36,38.75 36,48.5 v37.35,49.85
TRIG3
  Top 0.305: U1.11 30.52,49.08 25.7,44.25 25.7,31.9 25.34,31.54 25.34,28.57 25.35,28.56 25.35,27.15 26.2,26.3 28.25,26.3 28.87,25.68 ULTRASONIC_3.3
TXD0  (via drill 0.35)
  Top 0.305: U$1.3 38.27,12.27 v39.9,13.9 | v46.75,58.05 48.72,58.05 U1.35
  Bottom 0.305: v39.9,13.9 42.25,16.25 42.25,31 52.49,41.24 52.49,53.81 48.25,58.05 v46.75,58.05
VBAT
  Top 1.016: POWER.1 58.41,11.25 55.25,11.25 53.34,13.15 ON/OFF.3 53.34,15.54 53.8,16 D1.C
VBUS
  Top 0.61: CN1.1 38.45,4.85 39.45,3.85 41.75,3.85 42.7,4.8 42.7,8.05 44,9.35 46.05,9.35 47.5,10.8 47.5,12.1 48.34,12.95 ON/OFF.1
VCP
  Top 0.305: C4.2 46.91,35.01 U3.11
VINT
  Top 0.305: C3.1 45.57,33.06 U3.14

### Text on the board
tNames: IO34 | IO35 | IO32 | IO33 | +3V3 | +3V3 | GND | GND | GND | VCC | GND | +3V3 | IO14 | SDA | SCL | IO12 | LINE SENSOR | - | GND | ECHO | TRIG | +3V3 | +
bNames: MADE BY | ALI JOUBIR | ESP32 ROBOT | MOTOR | B | A | IO2 | IO16 | IO15 | IO4 | IO26 | IO25 | IO19 | IO27 | IO5 | IO18 | TRIG | ECHO | ULTRASONIC